# Altium schematic sheet 3-CPUPower.SchDoc
size 431 x 279 mm; Organization: ORGANIZATION; Address1: ADDRESS 1; Address2: ADDRESS 2; Address3: ADDRESS 3; Address4: ADDRESS 4; DocumentNumber: 3; Revision: -; SheetNumber: 3; SheetTotal: 14; ENG_APP_DATE: --/--/--; DSN_APP_DATE: --/--/--; CHK_APP_DATE: --/--/--
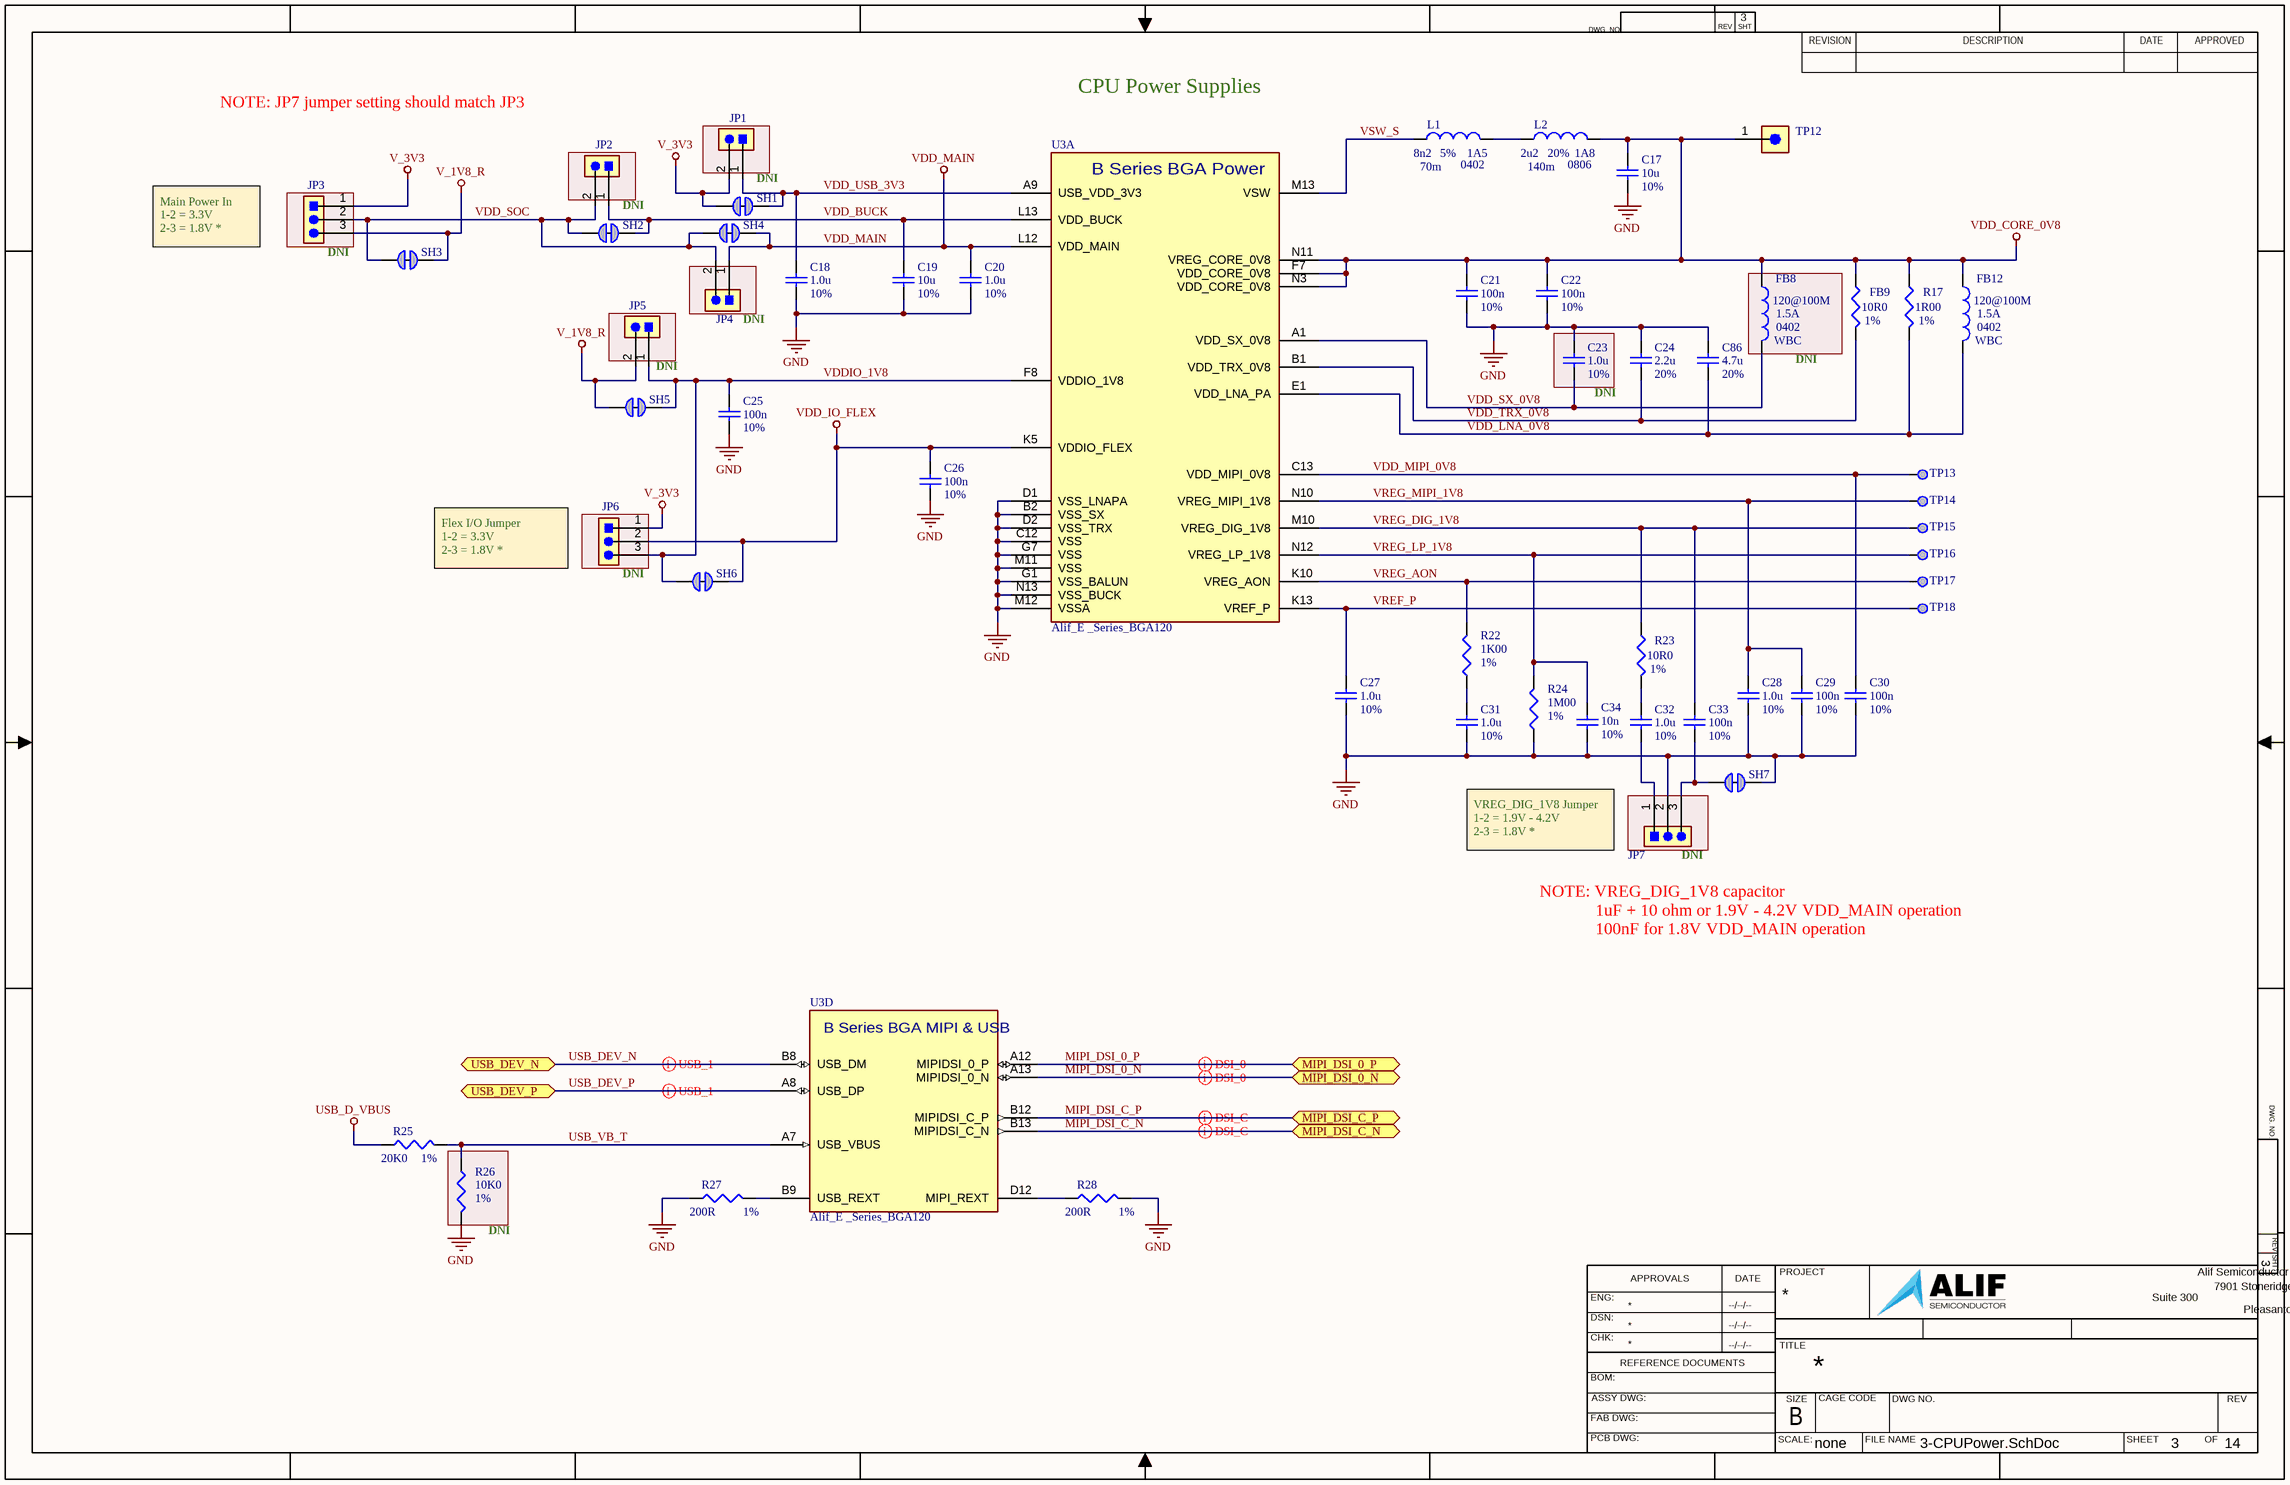
[diagram p0: 3-CPUPower.SchDoc]

## Parts
C17  value 10u  Tolerance: 10%  [CAPC0402-01]  (hidden comment: Cap)
C18  value 1.0u  Tolerance: 10%  [CAPC0402-01]  (hidden comment: Cap)
C19  value 10u  Tolerance: 10%  [CAPC0402-01]  (hidden comment: Cap)
C20  value 1.0u  Tolerance: 10%  [CAPC0402-01]  (hidden comment: Cap)
C21  value 100n  Tolerance: 10%  [CAPC0402-01]  (hidden comment: Cap)
C22  value 100n  Tolerance: 10%  [CAPC0402-01]  (hidden comment: Cap)
C23  value 1.0u  Tolerance: 10%  [CAPC0402-01]  (hidden comment: Cap)
C24  value 2.2u  Tolerance: 20%  [CAPC0402-01]  (hidden comment: Cap_225M25VX5R0402_1)
C25  value 100n  Tolerance: 10%  [CAPC0402-01]  (hidden comment: Cap)
C26  value 100n  Tolerance: 10%  [CAPC0402-01]  (hidden comment: Cap)
C27  value 1.0u  Tolerance: 10%  [CAPC0402-01]  (hidden comment: Cap)
C28  value 1.0u  Tolerance: 10%  [CAPC0402-01]  (hidden comment: Cap)
C29  value 100n  Tolerance: 10%  [CAPC0402-01]  (hidden comment: Cap)
C30  value 100n  Tolerance: 10%  [CAPC0402-01]  (hidden comment: Cap)
C31  value 1.0u  Tolerance: 10%  [CAPC0402-01]  (hidden comment: Cap)
C32  value 1.0u  Tolerance: 10%  [CAPC0402-01]  (hidden comment: Cap)
C33  value 100n  Tolerance: 10%  [CAPC0402-01]  (hidden comment: Cap)
C34  value 10n  Tolerance: 10%  [CAPC0402-01]  (hidden comment: Cap)
C86  value 4.7u  Tolerance: 20%  [CAPC0402-01]  (hidden comment: Cap)
FB8  value WBC  Impedance: 120@100M  PCB_Footprint: 0402  RMS_Current: 1.5A  [FB_0402_MuRata_as_R0402]  (hidden comment: Ind_WBC_1A5_120@100M0402_1)
FB9  value 10R0  Tolerance: 1%  [RESC0402-01]  (hidden comment: Res3)
FB12  value WBC  Impedance: 120@100M  PCB_Footprint: 0402  RMS_Current: 1.5A  [FB_0402_MuRata_as_R0402]  (hidden comment: Ind_WBC_1A5_120@100M0402_1)
JP1  TSW-102-07-G-S  [CONN_77311-146-02LF_AMP_HDR_1x2_2.5MM_STRT_no#D]  (value not drawn)
JP2  TSW-102-07-G-S  [CONN_77311-146-02LF_AMP_HDR_1x2_2.5MM_STRT_no#D]  (value not drawn)
JP3  TSW-103-07-G-S  [CONN_HDR_1X3_STRT_0.100_no3D]  (value not drawn)
JP4  TSW-102-07-G-S  [CONN_77311-146-02LF_AMP_HDR_1x2_2.5MM_STRT_no#D]  (value not drawn)
JP5  TSW-102-07-G-S  [CONN_77311-146-02LF_AMP_HDR_1x2_2.5MM_STRT_no#D]  (value not drawn)
JP6  TSW-103-07-G-S  [CONN_HDR_1X3_STRT_0.100_no3D]  (value not drawn)
JP7  TSW-103-07-G-S  [CONN_HDR_1X3_STRT_0.100_no3D]  (value not drawn)
L1  value 8n2  PCB_Footprint: 0402  DCR: 70m  RMS_Current: 1A5  Tolerance: 5%  [IND_WE-KI_0402]  (hidden comment: Inductor)
L2  value 2u2  PCB_Footprint: 0806  DCR: 140m  RMS_Current: 1A8  Tolerance: 20%  [IND_0806_2016_SAM]  (hidden comment: Inductor)
R17  value 1R00  Tolerance: 1%  [RESC0402-01]  (hidden comment: Res3)
R22  value 1K00  Tolerance: 1%  [RESC0402-01]  (hidden comment: Res3)
R23  value 10R0  Tolerance: 1%  [RESC0402-01]  (hidden comment: Res3)
R24  value 1M00  Tolerance: 1%  [RESC0402-01]  (hidden comment: Res3)
R25  value 20K0  Tolerance: 1%  [RESC0402-01]  (hidden comment: Res3)
R26  value 10K0  Tolerance: 1%  [RESC0402-01]  (hidden comment: Res3)
R27  value 200R  Tolerance: 1%  [RESC0402-01]  (hidden comment: Res3)
R28  value 200R  Tolerance: 1%  [RESC0402-01]  (hidden comment: Res3)
SH1  SolderJumperShorted_Small  [Solderbridge_Shorted]  (value not drawn)  (net tie, no BOM)
SH2  SolderJumperShorted_Small  [Solderbridge_Shorted]  (value not drawn)  (net tie, no BOM)
SH3  SolderJumperShorted_Small  [Solderbridge_Shorted]  (value not drawn)  (net tie, no BOM)
SH4  SolderJumperShorted_Small  [Solderbridge_Shorted]  (value not drawn)  (net tie, no BOM)
SH5  SolderJumperShorted_Small  [Solderbridge_Shorted]  (value not drawn)  (net tie, no BOM)
SH6  SolderJumperShorted_Small  [Solderbridge_Shorted]  (value not drawn)  (net tie, no BOM)
SH7  SolderJumperShorted_Small  [Solderbridge_Shorted]  (value not drawn)  (net tie, no BOM)
TP12  TSW-101-07-G-S  [CONN_77311-146-01LF_AMP_HDR_1X1_2.5MM_STRT_No3D]  (value not drawn)
TP13  TP_SMPAD  [TP_30_RND]  (value not drawn)  (no BOM)
TP14  TP_SMPAD  [TP_30_RND]  (value not drawn)  (no BOM)
TP15  TP_SMPAD  [TP_30_RND]  (value not drawn)  (no BOM)
TP16  TP_SMPAD  [TP_30_RND]  (value not drawn)  (no BOM)
TP17  TP_SMPAD  [TP_30_RND]  (value not drawn)  (no BOM)
TP18  TP_SMPAD  [TP_30_RND]  (value not drawn)  (no BOM)
U3  Alif_E _Series_BGA120  [BGA120_socket-NO_SOCK_3D]  (parts A,D of 4)

## Ports
MIPI_DSI_0_N (bidir), MIPI_DSI_0_P (bidir), MIPI_DSI_C_N (bidir), MIPI_DSI_C_P (bidir), USB_DEV_N (bidir), USB_DEV_P (bidir)

## Nets
GND: C17.1 C18.1 C19.1 C20.1 C21.1 C22.1 C23.2 C24.2 C25.1 C26.1 C27.1 C28.1 C29.1 C30.1 C31.1 C34.2 C86.2 JP7.2 R24.1 R26.2 R27.1 R28.2 SH7.2 U3.B2(VSS_SX) U3.C12(VSS) U3.D1(VSS_LNAPA) U3.D2(VSS_TRX) U3.G1(VSS_BALUN) U3.G7(VSS) U3.M11(VSS) U3.M12(VSSA) U3.N13(VSS_BUCK)
USB_D_VBUS: R25.1
V_1V8_R: JP3.3 JP5.2 SH3.2 SH5.1
V_3V3: JP1.2 JP3.1 JP6.1 SH1.1
VDD_CORE_0V8: C17.2 C21.2 C22.2 FB8.1 FB9.2 FB12.1 L2.2 R17.2 TP12.1 U3.F7(VDD_CORE_0V8) U3.N3(VDD_CORE_0V8) U3.N11(VREG_CORE_0V8)
VDD_IO_FLEX: C26.2 JP6.2 SH6.2 U3.K5(VDDIO_FLEX)
VDD_MAIN: C20.2 JP4.1 SH4.2 U3.L12(VDD_MAIN)
MIPI_DSI_0_N: U3.A13(MIPIDSI_0_N) ; port MIPI_DSI_0_N
MIPI_DSI_0_P: U3.A12(MIPIDSI_0_P) ; port MIPI_DSI_0_P
MIPI_DSI_C_N: U3.B13(MIPIDSI_C_N) ; port MIPI_DSI_C_N
MIPI_DSI_C_P: U3.B12(MIPIDSI_C_P) ; port MIPI_DSI_C_P
USB_DEV_N: U3.B8(USB_DM) ; port USB_DEV_N
USB_DEV_P: U3.A8(USB_DP) ; port USB_DEV_P
USB_VB_T: R25.2 R26.1 U3.A7(USB_VBUS)
VDD_BUCK: C19.2 JP2.1 SH2.2 U3.L13(VDD_BUCK)
VDD_LNA_0V8: C86.1 FB12.2 R17.1 U3.E1(VDD_LNA_PA)
VDD_MIPI_0V8: C30.2 TP13.1 U3.C13(VDD_MIPI_0V8)
VDD_SOC: JP2.2 JP3.2 JP4.2 SH2.1 SH3.1 SH4.1
VDD_SX_0V8: C23.1 FB8.2 U3.A1(VDD_SX_0V8)
VDD_TRX_0V8: C24.1 FB9.1 U3.B1(VDD_TRX_0V8)
VDD_USB_3V3: C18.2 JP1.1 SH1.2 U3.A9(USB_VDD_3V3)
VDDIO_1V8: C25.2 JP5.1 JP6.3 SH5.2 SH6.1 U3.F8(VDDIO_1V8)
VREF_P: C27.2 TP18.1 U3.K13(VREF_P)
VREG_AON: R22.2 TP17.1 U3.K10(VREG_AON)
VREG_DIG_1V8: C33.2 R23.2 TP15.1 U3.M10(VREG_DIG_1V8)
VREG_LP_1V8: C34.1 R24.2 TP16.1 U3.N12(VREG_LP_1V8)
VREG_MIPI_1V8: C28.2 C29.2 TP14.1 U3.N10(VREG_MIPI_1V8)
VSW_S: L1.1 U3.M13(VSW)
NetC31_2: C31.2 R22.1
NetC32_1: C32.1 JP7.1
NetC32_2: C32.2 R23.1
NetC33_1: C33.1 JP7.3 SH7.1
NetL1_2: L1.2 L2.1
NetR27_2: R27.2 U3.B9(USB_REXT)
NetR28_1: R28.1 U3.D12(MIPI_REXT)

## Layout directives
differential pair; differential pair class MIPI_DSI_0_: MIPI_DSI_0_N, MIPI_DSI_0_P
differential pair; differential pair class MIPI_DSI_C_: MIPI_DSI_C_N, MIPI_DSI_C_P
differential pair; differential pair class USB_DEV_: USB_DEV_N, USB_DEV_P

## Notes on the sheet
- CPU Power Supplies
- NOTE: JP7 jumper setting should match JP3
- DNI
- Main Power In
  1-2 = 3.3V
  2-3 = 1.8V *
- (near JP3) DNI
- (near JP5) DNI
- Flex I/O Jumper
  1-2 = 3.3V
  2-3 = 1.8V *
- (near JP6) DNI
- VREG_DIG_1V8 Jumper
  1-2 = 1.9V - 4.2V
  2-3 = 1.8V *
- NOTE: VREG_DIG_1V8 capacitor
- (near JP7) DNI
- 1uF + 10 ohm or 1.9V - 4.2V VDD_MAIN operation
- 100nF for 1.8V VDD_MAIN operation
- (near R26) DNI
- DWG. NO.
- REV
- SHT
- REVISION
- DESCRIPTION
- DATE
- APPROVED
- ENG:
- APPROVALS
- PROJECT
- Suite 300
- Alif Semiconductor
- 7901 Stoneridge Drive
- DSN:
- CHK:
- REFERENCE DOCUMENTS
- TITLE
- Pleasanton, CA 94588  USA
- BOM:
- FAB DWG:
- PCB DWG:
- ASSY DWG:
- SCALE:
- SIZE
- B
- CAGE CODE
- FILE NAME
- DWG NO.
- SHEET
- OF
- none
- (in symbol SPARK_B1_120BGA_A5, part A) B Series BGA Power
- (in symbol SPARK_B1_120BGA_A5, part D) B Series BGA MIPI & USB

## Library data of the parts
C17 C19 = Cap: Cap,10uF,20%,10V,X5R,0402; Manufacturer 1: AVX; Manufacturer Part Number 1: 0402ZD106MAT2A; PCB_Footprint: CC0402; Published: 8-Jun-2000; LatestRevisionDate: 17-Jul-2002; LatestRevisionNote: Re-released for DXP Platform.; PackageReference: RAD-0.3; Publisher: Altium Limited; PackageDescription: Radial Cap, Thru-Hole; 2 Leads; 0.3 in Pin Spacing; Max_Height: 0.60mm; Manufacturer 2: Samsung; Manufacturer Part Number 2: CL05A106MP5NUNC; Manufacturer 3: Venkel; Manufacturer Part Number 3: C0402X5R100-106MNP; Type: X5R; Voltage: 10V
C18 C20 C27 C28 C31 C32 = Cap: Cap,1.0uF,20%,25V,X5R,0402; Manufacturer 1: TDK; Manufacturer Part Number 1: CGB2A1X5R1E105K033BC; PCB_Footprint: CC0402; Published: 8-Jun-2000; LatestRevisionDate: 17-Jul-2002; LatestRevisionNote: Re-released for DXP Platform.; PackageReference: RAD-0.3; Publisher: Altium Limited; PackageDescription: Radial Cap, Thru-Hole; 2 Leads; 0.3 in Pin Spacing; Max_Height: 0.60mm; Manufacturer 2: Yageo; Manufacturer Part Number 2: CC0402KRX5R8BB105; Manufacturer 3: Murata; Manufacturer Part Number 3: GRM155R61E105KA12D; Type: X5R; Voltage: 25V
C21 C22 C25 C26 C29 C30 C33 = Cap: Cap,100nF,10%,50V,X7R,0402; Manufacturer 1: TDK; Manufacturer Part Number 1: C1005X7R1H104K050BE; PCB_Footprint: CC0402; Published: 8-Jun-2000; LatestRevisionDate: 17-Jul-2002; LatestRevisionNote: Re-released for DXP Platform.; PackageReference: RAD-0.3; Publisher: Altium Limited; PackageDescription: Radial Cap, Thru-Hole; 2 Leads; 0.3 in Pin Spacing; Max_Height: 0.60mm; Manufacturer 2: Samsung; Manufacturer Part Number 2: CL05B104KB54PNC; Manufacturer 3: Walsin; Manufacturer Part Number 3: 0402B104K500CT; Type: X7R; Voltage: 50V
C23 = Cap: DNI,Cap,1.0uF,20%,25V,X5R,0402; Manufacturer 1: TDK; Manufacturer Part Number 1: CGB2A1X5R1E105K033BC; PCB_Footprint: CC0402; Published: 8-Jun-2000; LatestRevisionDate: 17-Jul-2002; LatestRevisionNote: Re-released for DXP Platform.; PackageReference: RAD-0.3; Publisher: Altium Limited; PackageDescription: Radial Cap, Thru-Hole; 2 Leads; 0.3 in Pin Spacing; Max_Height: 0.60mm; Manufacturer 2: Yageo; Manufacturer Part Number 2: CC0402KRX5R8BB105; Manufacturer 3: Murata; Manufacturer Part Number 3: GRM155R61E105KA12D; Type: X5R; Voltage: 25V
C24 = Cap_225M25VX5R0402_1: Cap,2.2uF,20%,25V,X5R,0402; Manufacturer 1: TDK; Manufacturer Part Number 1: C1005X5R1E225M050BC; PCB_Footprint: CC0402; Published: 8-Jun-2000; LatestRevisionDate: 17-Jul-2002; LatestRevisionNote: Re-released for DXP Platform.; PackageReference: RAD-0.3; Publisher: Altium Limited; PackageDescription: Radial Cap, Thru-Hole; 2 Leads; 0.3 in Pin Spacing; Max_Height: 0.60mm; Type: X5R; Voltage: 25V; Manufacturer 2: Murata; Manufacturer Part Number 2: GRM155R61E225ME11D; Manufacturer 3: Murata; Manufacturer Part Number 3: GRM155R61E225ME15D
C34 = Cap: Cap,10nF,10%,50V,X7R,0402; Manufacturer 1: TDK; Manufacturer Part Number 1: CGA2B3X7R1H103K050BE; PCB_Footprint: CC0402; Published: 8-Jun-2000; LatestRevisionDate: 17-Jul-2002; LatestRevisionNote: Re-released for DXP Platform.; PackageReference: RAD-0.3; Publisher: Altium Limited; PackageDescription: Radial Cap, Thru-Hole; 2 Leads; 0.3 in Pin Spacing; Max_Height: 0.60mm; Manufacturer 2: Samsung; Manufacturer Part Number 2: CL05B103KB5NNNC; Manufacturer 3: Walsin; Manufacturer Part Number 3: 0402B103K500CT; Type: X7R; Voltage: 50V
C86 = Cap_225M25VX5R0402_1: Cap,4.7uF,20%,10V,X5R,0402; Manufacturer 1: TDK; Manufacturer Part Number 1: C1005X5R1A475K050BC; PCB_Footprint: CC0402; Published: 8-Jun-2000; LatestRevisionDate: 17-Jul-2002; LatestRevisionNote: Re-released for DXP Platform.; PackageReference: RAD-0.3; Publisher: Altium Limited; PackageDescription: Radial Cap, Thru-Hole; 2 Leads; 0.3 in Pin Spacing; Max_Height: 0.60mm; Type: X5R; Voltage: 10V; Manufacturer 2: Kyocera; Manufacturer Part Number 2: 0402YD475MAT2A; Manufacturer 3: Samsung; Manufacturer Part Number 3: CL05A475MP5NRNC
FB8 = Ind_WBC_1A5_120@100M0402_1: DNI,Ind,WidebandChoke,1.5A,120ohm@100MHz,95mOhm,0402; Manufacturer 1: Murata; Manufacturer Part Number 1: BLM15EG121SN1D; Code_IEC: 1005; DCR: 143m; Tolerance: 30%; Published: 8-Jun-2000; LatestRevisionDate: 29-May-2009; LatestRevisionNote: IPC-7351 Footprint Added.; PackageReference: 0402-A; Publisher: Altium Limited; PackageDescription: Chip Inductor; Code_JEITA: 0402; Sat_Current: *; Type: *; Manufacturer 2: *; Manufacturer Part Number 2: *; Manufacturer 3: *; Manufacturer Part Number 3: *; Max_Height: 0.60mm
FB9 = Res3: Res,10R0,1%,100ppm,0402; Manufacturer 1: Vishay; Manufacturer Part Number 1: CRCW040210R0FKED; Wattage: 63mW; Type: Thick Film; Published: 8-Jun-2000; LatestRevisionDate: 29-May-2009; LatestRevisionNote: IPC-7351 Footprint Added.; PackageReference: RESC0402-01; Publisher: Altium Limited; PackageDescription: Chip Resistor; Voltage: *; Manufacturer 2: KOA; Manufacturer Part Number 2: RK73H1ETTP10R0F; Manufacturer 3: Stackpol; Manufacturer Part Number 3: RMCF0402FT10R0; PCB_Footprint: RESC0402-01
FB12 = Ind_WBC_1A5_120@100M0402_1: Ind,WidebandChoke,1.5A,120ohm@100MHz,95mOhm,0402; Manufacturer 1: Murata; Manufacturer Part Number 1: BLM15EG121SN1D; Code_IEC: 1005; DCR: 143m; Tolerance: 30%; Published: 8-Jun-2000; LatestRevisionDate: 29-May-2009; LatestRevisionNote: IPC-7351 Footprint Added.; PackageReference: 0402-A; Publisher: Altium Limited; PackageDescription: Chip Inductor; Code_JEITA: 0402; Sat_Current: *; Type: *; Manufacturer 2: *; Manufacturer Part Number 2: *; Manufacturer 3: *; Manufacturer Part Number 3: *; Max_Height: 0.60mm
JP1 JP2 JP4 JP5 = Hdr_M_1X2_2M54_STRT_UNSHROUD: DNI,Hdr, 0.025" SQ Post Header, Through-hole, Vertical, -55 to 125 degC, 2.54 mm Pitch, 2-Pin, Male, RoHS; Manufacturer: Samtec; Manufacturer Part Number 1: TSW-102-07-L-S; Pitch: 2.54 mm; ComponentLink3URL: http://www.samtec.com/documents/webfiles/cpdf/TSW-XXX-XX-XXX-X-XX-XXX-MKT.pdf; Temperature Range: -55 to 125 degC; DatasheetVersion: F-214; ComponentLink1Description: Manufacturer URL; ComponentLink2URL: http://www.samtec.com/documents/webfiles/pdf/TSW_TH.PDF; RoHS: True; Orientation: Vertical; ComponentLink2Description: Datasheet; ComponentLink3Description: Package Specification; PackageDescription: .025[0.64] SQ. Post Terminal Strip Assembly; Mounting Technology: Through-hole; PackageVersion: DM, 8/1988; ComponentLink1URL: http://www.samtec.com; PackageReference: *; PartNumber: *; Manufacturer 1: Samtec; Manufacturer 2: Amphenol; Manufacturer Part Number 2: 77311-102-02LF
JP3 JP6 JP7 = Hdr_M_1X3_2M54_STRT_UNSHROUD: DNI,Hdr, 0.025" SQ Post Header, Through-hole, Vertical, -55 to 125 degC, 2.54 mm Pitch, 3-Pin, Male, RoHS; Manufacturer: Samtec; Pitch: 2.54 mm; ComponentLink3URL: http://www.samtec.com/documents/webfiles/cpdf/TSW-XXX-XX-XXX-X-XX-XXX-MKT.pdf; Temperature Range: -55 to 125 degC; DatasheetVersion: F-214; ComponentLink1Description: Manufacturer URL; ComponentLink2URL: http://www.samtec.com/documents/webfiles/pdf/TSW_TH.PDF; RoHS: True; Orientation: Vertical; ComponentLink2Description: Datasheet; ComponentLink3Description: Package Specification; PackageDescription: .025[0.64] SQ. Post Terminal Strip Assembly; Mounting Technology: Through-hole; PackageVersion: DM, 8/1988; ComponentLink1URL: http://www.samtec.com; PackageReference: TSW-103-07-X-S; PartNumber: TSW-103-07-G-S; Manufacturer 1: Samtec; Manufacturer Part Number 1: TSW-103-07-G-S; Manufacturer 2: Sullins; Manufacturer Part Number 2: PRPC003SAAN-RC; Manufacturer 3: 3M; Manufacturer Part Number 3: 929647-01-03-I
L1 = Inductor: Ind,Unshielded,8.2nH,<5%,1.5A,<70mOhm, SRF > 4GHz, 0402; Manufacturer 1: Delta; Manufacturer Part Number 1: 0402HP-8N2EGTS; Published: 8-Jun-2000; LatestRevisionDate: 29-May-2009; LatestRevisionNote: IPC-7351 Footprint Added.; PackageReference: 0402; Publisher: Altium Limited; PackageDescription: Chip Inductor; Code_JEITA: 0402; Code_IEC: 0402; Sat_Current: *; Impedance: *; Type: *; Manufacturer 2: MuRata; Manufacturer Part Number 2: LQW15AN8N2G80D; Manufacturer 3: CoilCraft; Manufacturer Part Number 3: 0402DC-8N2XGRW; Max_Height: 0.70mm
L2 = Inductor: Ind,Shielded,Metal Comp,2.2uH,20%,1.8A,<140mOhm,0806(2016); Manufacturer 1: Samsung; Manufacturer Part Number 1: CIGT201610LH2R2MNE; Code_IEC: 2520; Published: 8-Jun-2000; LatestRevisionDate: 29-May-2009; LatestRevisionNote: IPC-7351 Footprint Added.; PackageReference: L1008; Publisher: Altium Limited; PackageDescription: Chip Inductor; Code_JEITA: 2520; Sat_Current: *; Impedance: *; Type: *; Manufacturer 2: Littlefuse; Manufacturer Part Number 2: LPWI201610H2R2T; Manufacturer 3: *; Manufacturer Part Number 3: *; Max_Height: 0.60mm
R17 = Res3: Res,1R00,1%,100ppm,0402; Manufacturer 1: Vishay; Manufacturer Part Number 1: CRCW04021R00FKED; Wattage: 63mW; Published: 8-Jun-2000; LatestRevisionDate: 29-May-2009; LatestRevisionNote: IPC-7351 Footprint Added.; PackageReference: RESC0402-01; Publisher: Altium Limited; PackageDescription: Chip Resistor; Voltage: *; Type: Thick Film; Manufacturer 2: KOA; Manufacturer Part Number 2: RK73H1ETTP1R00F; Manufacturer 3: Stackpol; Manufacturer Part Number 3: RMCF0402FT1R00; PCB_Footprint: RESC0402-01
R22 = Res3: Res,1K00,1%,100ppm,0402; Manufacturer 1: Stackpol; Manufacturer Part Number 1: RMCF0402FT1K; Wattage: 63mW; Published: 8-Jun-2000; LatestRevisionDate: 29-May-2009; LatestRevisionNote: IPC-7351 Footprint Added.; PackageReference: RESC0402-01; Publisher: Altium Limited; PackageDescription: Chip Resistor; Voltage: *; Type: Thick Film; Manufacturer 2: Yageo; Manufacturer Part Number 2: RC0402FR-071KL; Manufacturer 3: Bourns; Manufacturer Part Number 3: CR0402-FX-1001GLF; PCB_Footprint: RESC0402-01
R23 = Res3: Res,10R0,1%,100ppm,0402; Manufacturer 1: Vishay; Manufacturer Part Number 1: CRCW040210R0FKED; Wattage: 63mW; Published: 8-Jun-2000; LatestRevisionDate: 29-May-2009; LatestRevisionNote: IPC-7351 Footprint Added.; PackageReference: RESC0402-01; Publisher: Altium Limited; PackageDescription: Chip Resistor; Voltage: *; Type: Thick Film; Manufacturer 2: KOA; Manufacturer Part Number 2: RK73H1ETTP10R0F; Manufacturer 3: Stackpol; Manufacturer Part Number 3: RMCF0402FT10R0; PCB_Footprint: RESC0402-01
R24 = Res3: Res,1M00,1%,100ppm,0402; Manufacturer 1: Stackpol; Manufacturer Part Number 1: RMCF0402FT1M00; Wattage: 63mW; Published: 8-Jun-2000; LatestRevisionDate: 29-May-2009; LatestRevisionNote: IPC-7351 Footprint Added.; PackageReference: RESC0402-01; Publisher: Altium Limited; PackageDescription: Chip Resistor; Voltage: *; Type: Thick Film; Manufacturer 2: Yageo; Manufacturer Part Number 2: RC0402FR-071ML; Manufacturer 3: Bourns; Manufacturer Part Number 3: CR0402-FX-1004GLF; PCB_Footprint: RESC0402-01
R25 = Res3: Res,20K0,1%,100ppm,0402; Manufacturer 1: Stackpol; Manufacturer Part Number 1: RMCF0402FT20K0; Wattage: 63mW; Published: 8-Jun-2000; LatestRevisionDate: 29-May-2009; LatestRevisionNote: IPC-7351 Footprint Added.; PackageReference: RESC0402-01; Publisher: Altium Limited; PackageDescription: Chip Resistor; Voltage: *; Type: Thick Film; Manufacturer 2: Yageo; Manufacturer Part Number 2: RC0402FR-0720KL; Manufacturer 3: Bourns; Manufacturer Part Number 3: CR0402-FX-2002GLF; PCB_Footprint: RESC0402-01
R26 = Res3: DNI,Res,10K0,1%,100ppm,0402; Manufacturer 1: Stackpol; Manufacturer Part Number 1: RMCF0402FT10K0; Wattage: 63mW; Published: 8-Jun-2000; LatestRevisionDate: 29-May-2009; LatestRevisionNote: IPC-7351 Footprint Added.; PackageReference: RESC0402-01; Publisher: Altium Limited; PackageDescription: Chip Resistor; Voltage: *; Type: Thick Film; Manufacturer 2: Yageo; Manufacturer Part Number 2: RC0402FR-0710KL; Manufacturer 3: Bourns; Manufacturer Part Number 3: CR0402-FX-1002GLF; PCB_Footprint: RESC0402-01
R27 R28 = Res3: Res,200R,1%,100ppm,0402; Manufacturer 1: Stackpol; Manufacturer Part Number 1: RMCF0402FT220R; Wattage: 63mW; Published: 8-Jun-2000; LatestRevisionDate: 29-May-2009; LatestRevisionNote: IPC-7351 Footprint Added.; PackageReference: RESC0402-01; Publisher: Altium Limited; PackageDescription: Chip Resistor; Voltage: *; Type: Thick Film; Manufacturer 2: Yageo; Manufacturer Part Number 2: RC0402FR-07200RL; Manufacturer 3: Bourns; Manufacturer Part Number 3: CR0402-FX-2000GLF; PCB_Footprint: RESC0402-01
SH1-SH7 = SolderJumperShorted_Small: DNI,Solderable Jumper,Shorted; Wattage: 63mW; PCB_Footprint: SSHORTED; Published: 8-Jun-2000; LatestRevisionDate: 29-May-2009; LatestRevisionNote: IPC-7351 Footprint Added.; PackageReference: J1-0603; Publisher: Altium Limited; PackageDescription: Chip Resistor; Voltage: *; Type: Thick Film; Manufacturer 1: *; Manufacturer Part Number 1: *; Manufacturer 2: *; Manufacturer Part Number 2: *; Manufacturer 3: *; Manufacturer Part Number 3: *; Tolerance: *; Value: *
TP12 = Hdr_M_1X1_2M54_STRT_UNSHROUD: DNI,Hdr, 0.025" SQ Post Header, Through-hole, Vertical, -55 to 125 degC, 2.54 mm Pitch, 1-Pin, Male, RoHS; Manufacturer: Samtec; Manufacturer Part Number 1: TSW-101-07-L-S; Pitch: 2.54 mm; ComponentLink3URL: http://www.samtec.com/documents/webfiles/cpdf/TSW-XXX-XX-XXX-X-XX-XXX-MKT.pdf; Temperature Range: -55 to 125 degC; DatasheetVersion: F-214; ComponentLink1Description: Manufacturer URL; ComponentLink2URL: http://www.samtec.com/documents/webfiles/pdf/TSW_TH.PDF; RoHS: True; Orientation: Vertical; ComponentLink2Description: Datasheet; ComponentLink3Description: Package Specification; PackageDescription: .025[0.64] SQ. Post Terminal Strip Assembly; Mounting Technology: Through-hole; PackageVersion: DM, 8/1988; ComponentLink1URL: http://www.samtec.com; PackageReference: *; PartNumber: *; Manufacturer 1: Samtec; Manufacturer 2: Amphenol; Manufacturer Part Number 2: 77311-101-01LF
TP13-TP18 = TP_SMPAD: Test Point, SMT Pad,--not a BOM item--; PCB_Footprint: TP_PAD1
U3 = SPARK_B1_120BGA_A5: IC,Alif Spark B1 MCU, Rev A5 silicon,BGA120; Manufacturer 1: Alif Semi; Manufacturer Part Number 1: AB1C1F4M51820PH0